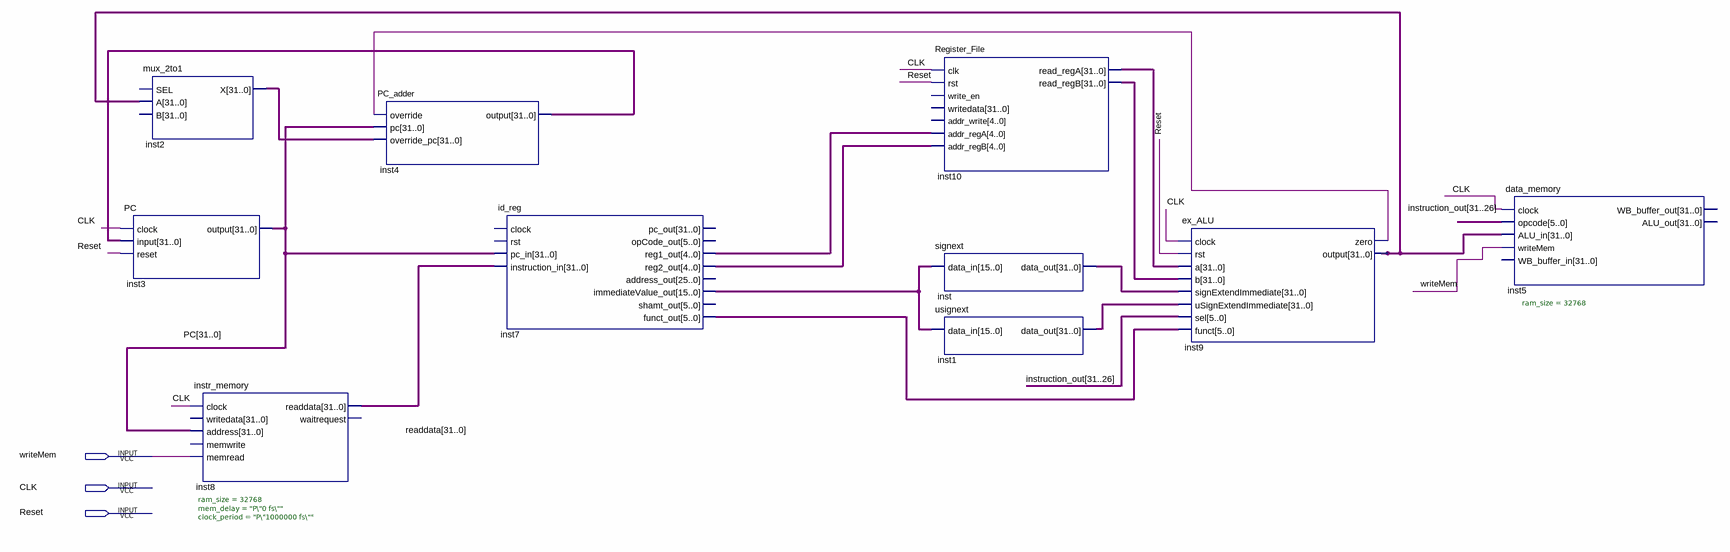
[diagram p0: schematic sheet]
// Quartus schematic P4.bdf as structural Verilog: 10 symbols, 3 pins
module P4 (
  input  writeMem,
  input  CLK,
  input  Reset
);

  wire inst9_zero;
  wire [4:0] inst7_reg1_out, inst7_reg2_out;
  wire [5:0] inst7_funct_out;
  wire [15:0] inst7_immediatevalue_out;
  wire [31:0] inst1_data_out, inst2_x, inst4_output, inst9_output, inst10_read_rega, inst10_read_regb,
       inst_data_out, PC, readdata;
  wire [31:26] instruction_out;

  mux_2to1 inst2 (.A(inst9_output), .X(inst2_x));  // open: SEL, B
  PC inst3 (.clock(CLK), .\input (inst4_output), .reset(Reset), .\output (PC));
  instr_memory #(.ram_size(32768), .mem_delay("P\"0 fs\""), .clock_period("P\"1000000 fs\"")) inst8 (
    .clock(CLK), .address(PC), .memread(writeMem), .readdata(readdata));  // open: writedata, memwrite, waitrequest
  PC_adder inst4 (.override(inst9_zero), .pc(PC), .override_pc(inst2_x), .\output (inst4_output));
  id_reg inst7 (
    .pc_in(PC), .instruction_in(readdata), .reg1_out(inst7_reg1_out), .reg2_out(inst7_reg2_out),
    .immediateValue_out(inst7_immediatevalue_out), .funct_out(inst7_funct_out));  // open: clock, rst, pc_out, opCode_out, address_out, shamt_out
  Register_File inst10 (
    .clk(CLK), .rst(Reset), .addr_regA(inst7_reg1_out), .addr_regB(inst7_reg2_out),
    .read_regA(inst10_read_rega), .read_regB(inst10_read_regb));  // open: write_en, writedata, addr_write
  signext inst (.data_in(inst7_immediatevalue_out), .data_out(inst_data_out));
  usignext inst1 (.data_in(inst7_immediatevalue_out), .data_out(inst1_data_out));
  ex_ALU inst9 (
    .clock(CLK), .rst(Reset), .a(inst10_read_rega), .b(inst10_read_regb),
    .signExtendImmediate(inst_data_out), .uSignExtendImmediate(inst1_data_out), .sel(instruction_out),
    .funct(inst7_funct_out), .zero(inst9_zero), .\output (inst9_output));
  data_memory #(.ram_size(32768)) inst5 (
    .clock(CLK), .opcode(instruction_out), .ALU_in(inst9_output), .writeMem(writeMem));  // open: WB_buffer_in, WB_buffer_out, ALU_out
endmodule
